# EasyEDA schematic 1-Schematic_RGBDiceTray_3.1.json

## Sheets
1 RGBDiceTray_Potentiometer: TITLE: RGBDiceTray_Potentiometer; REV: 1.0; Date: 2019-11-29; Sheet: 1/1; Drawn By: harrisongrout; Company: Your Company
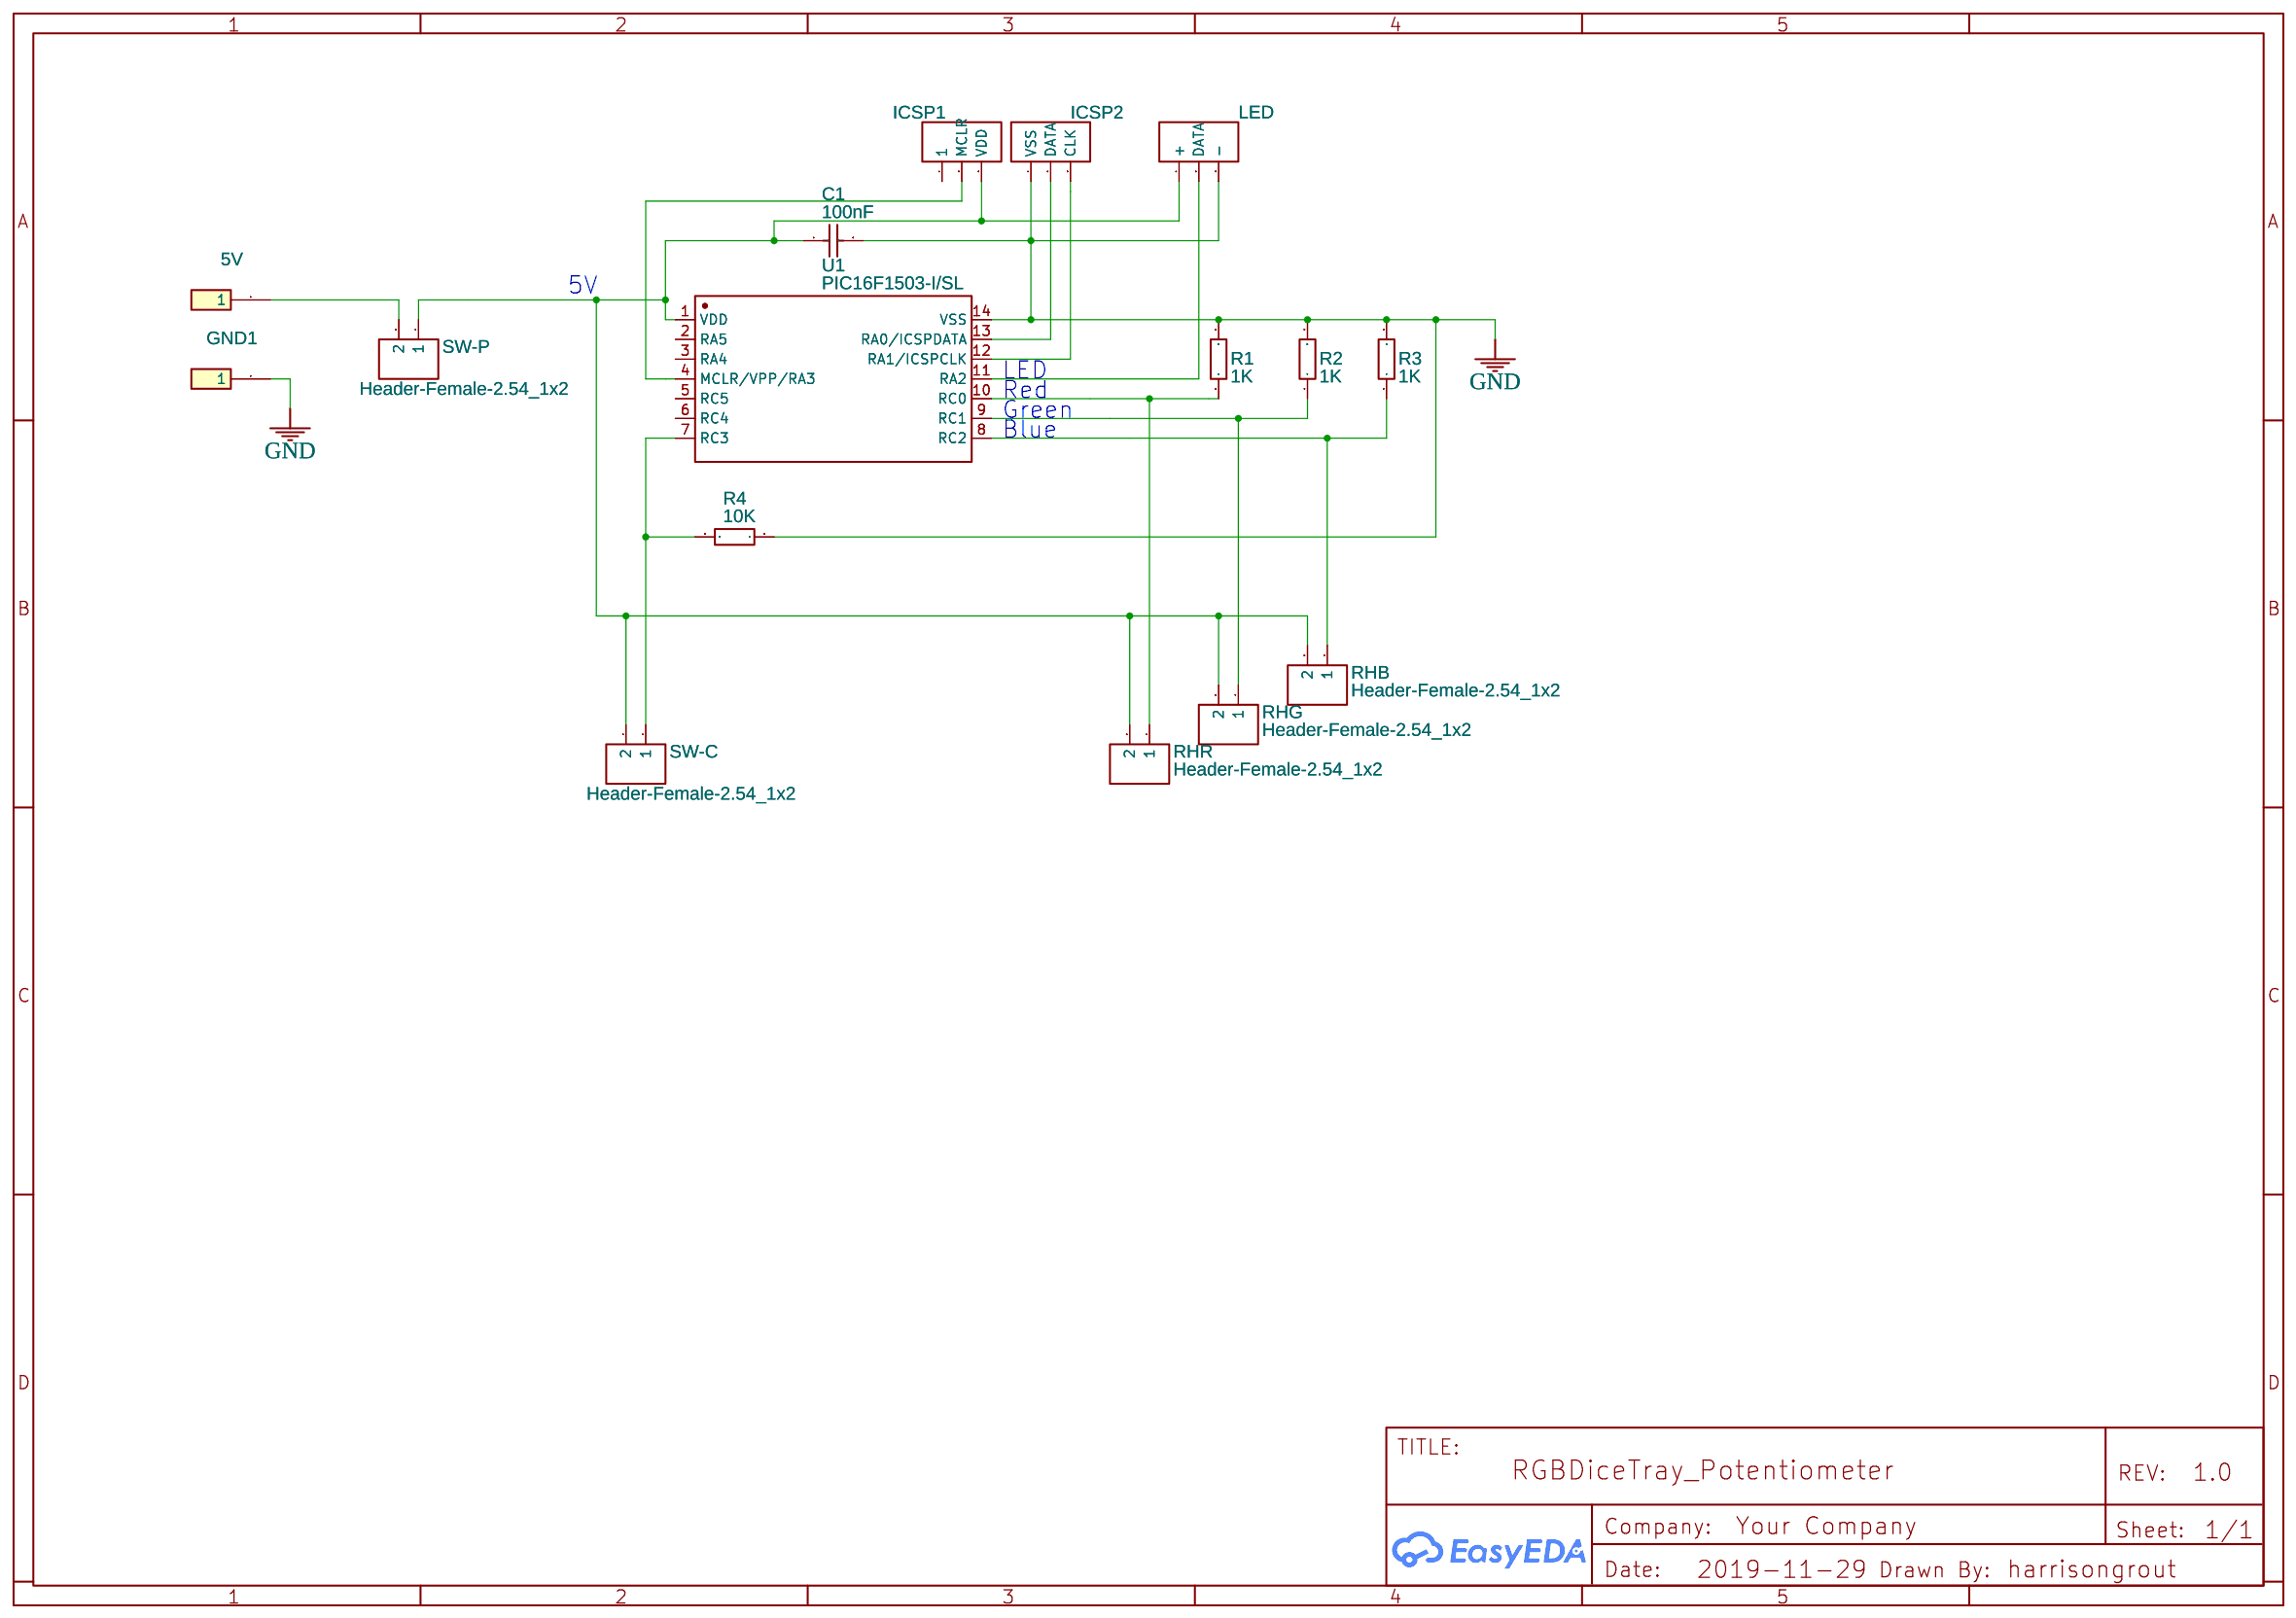
[diagram p0: RGBDiceTray_Potentiometer]
2 ButtonInterface: TITLE: Button Interface; Date: 2019-11-30
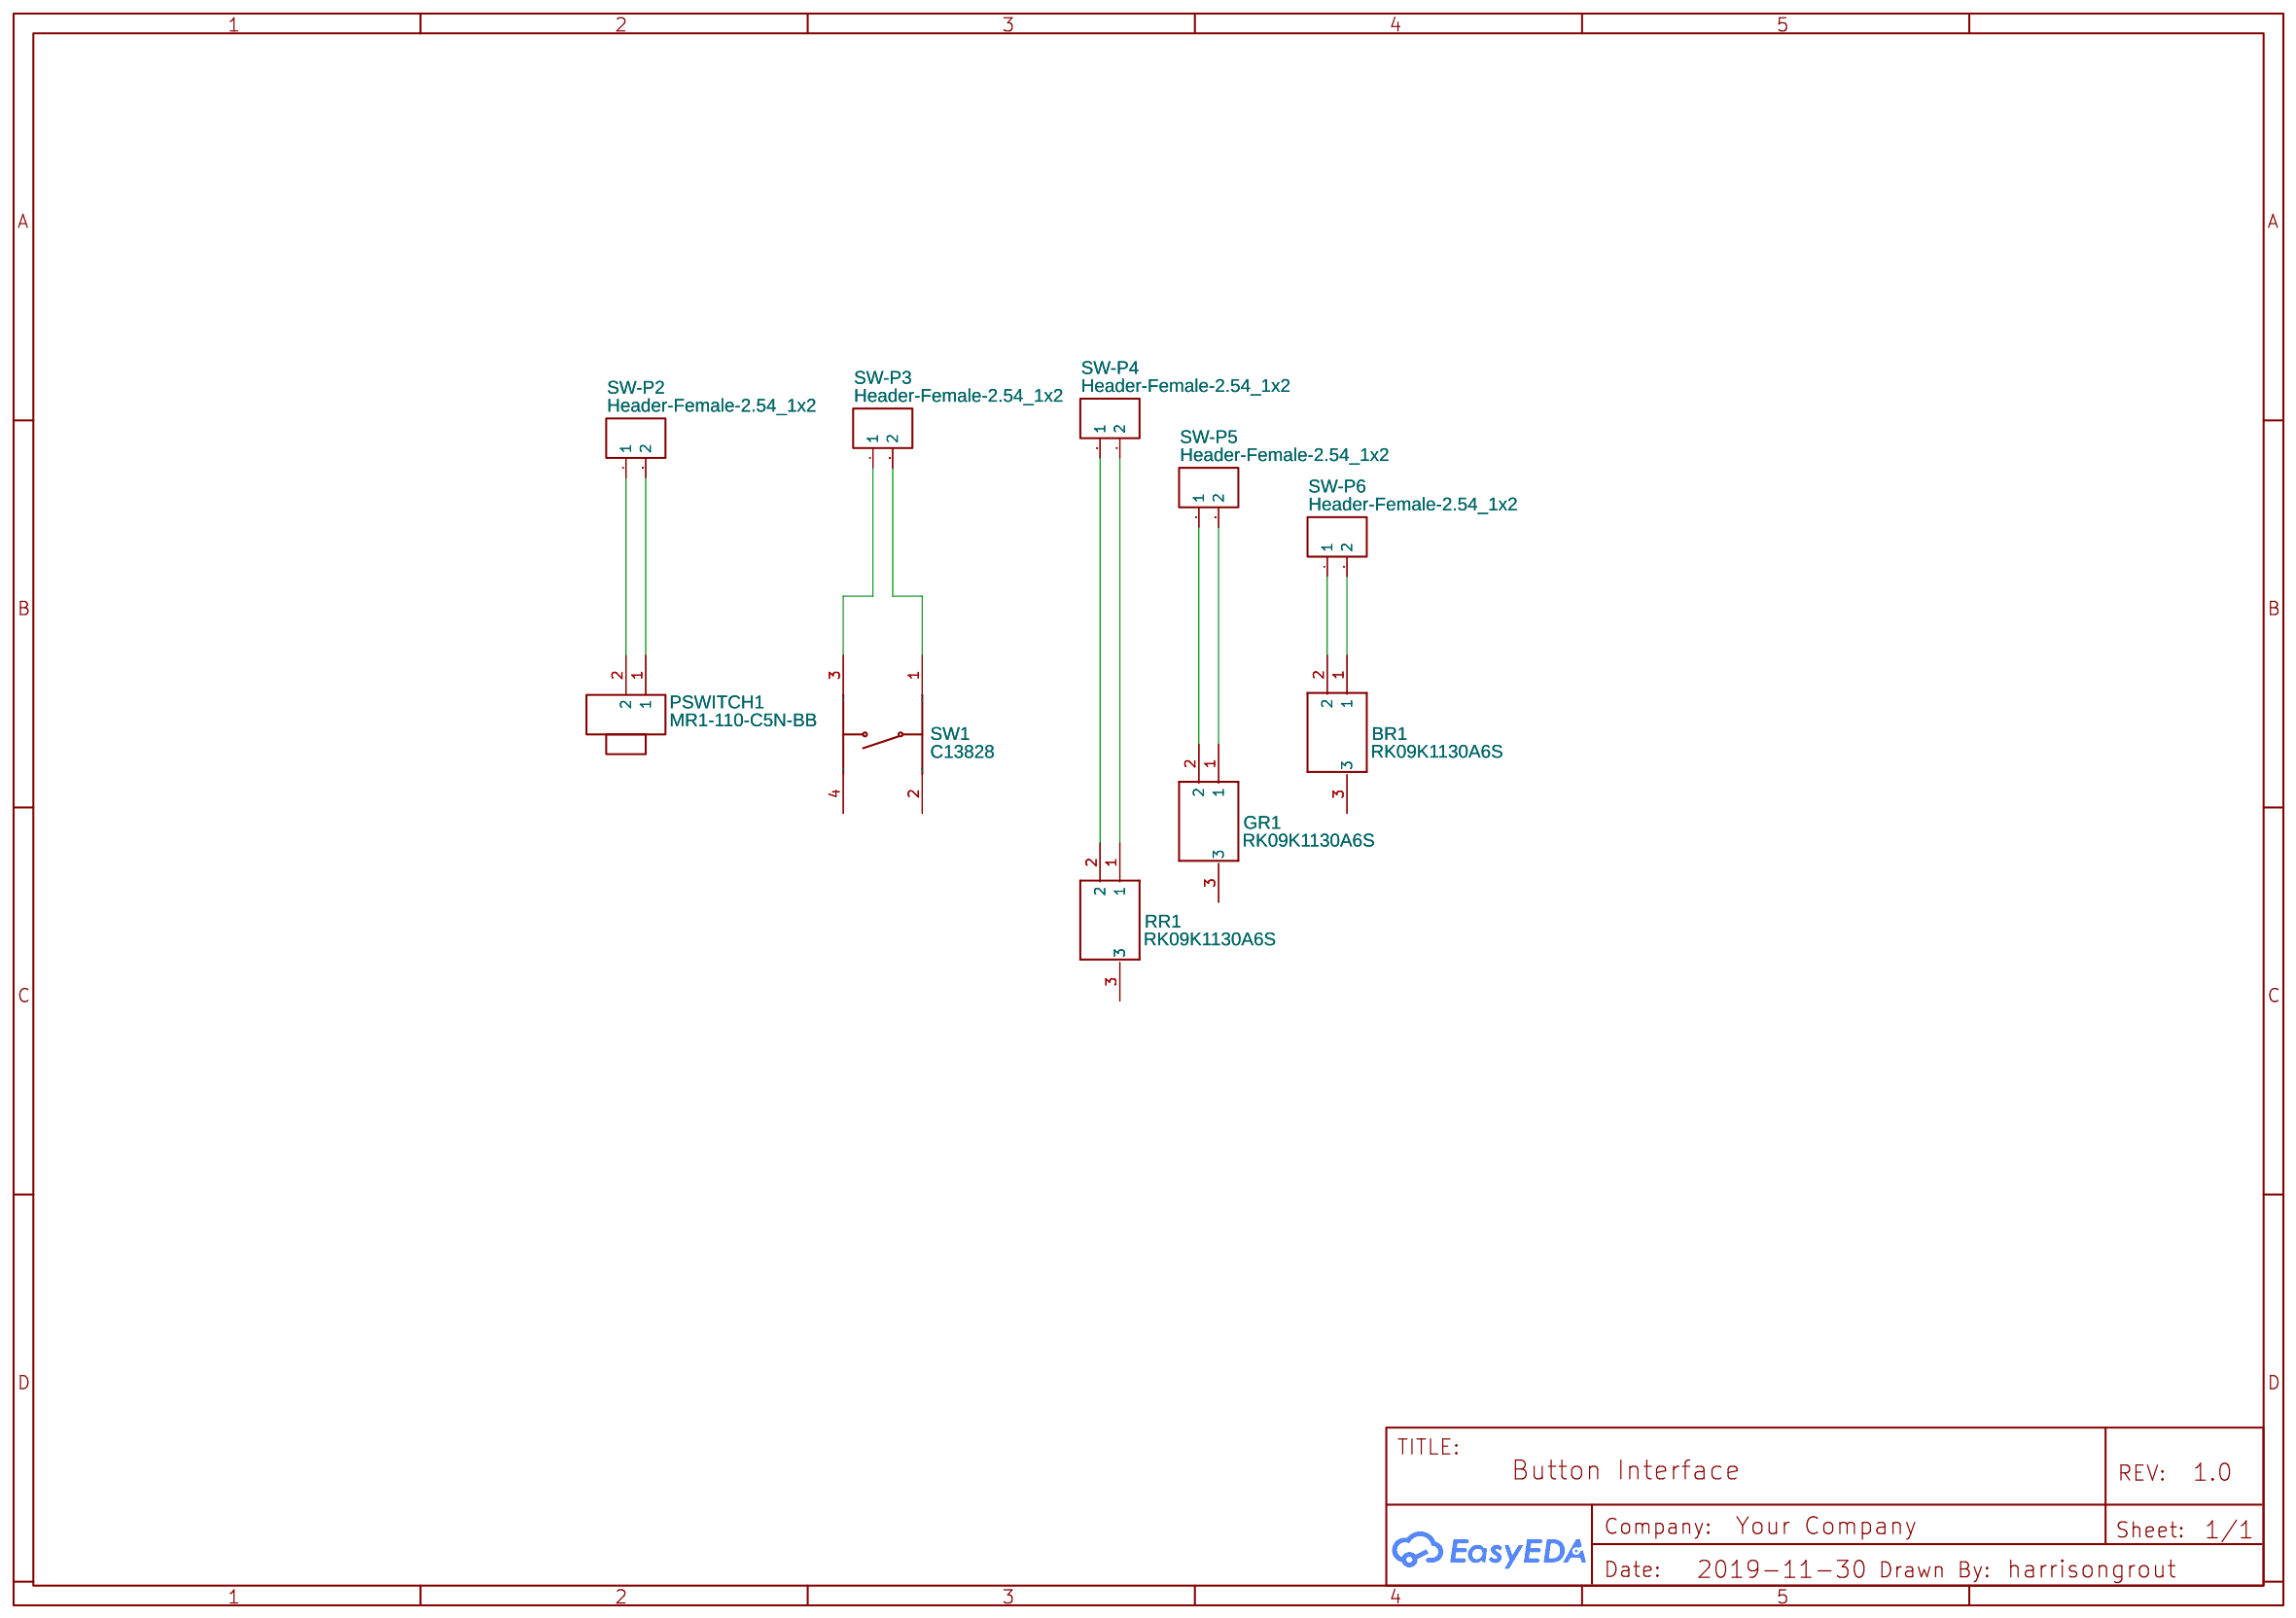
[diagram p1: ButtonInterface]

## Parts
sheet ButtonInterface
#1  -
BR1  RK09K1130A6S  [RK09K1130BGM]
GR1  RK09K1130A6S  [RK09K1130BGM]
PSWITCH1  MR1-110-C5N-BB  [601-10211BB-3P]
RR1  RK09K1130A6S  [RK09K1130BGM]
SW1  C13828  [SW-TH_4P-L6.0-W6.0-P4.50-LS6.5]
SW-P2  Header-Female-2.54_1x2  [HDR-TH_2P-P2.54-V-M]
SW-P3  Header-Female-2.54_1x2  [HDR-TH_2P-P2.54-V-M]
SW-P4  Header-Female-2.54_1x2  [HDR-TH_2P-P2.54-V-M]
SW-P5  Header-Female-2.54_1x2  [HDR-TH_2P-P2.54-V-M]
SW-P6  Header-Female-2.54_1x2  [HDR-TH_2P-P2.54-V-M]
sheet RGBDiceTray_Potentiometer
5V  5V  [HDR-1X1/2.54]
C1  100nF  [0402]
GND1  GND  [HDR-1X1/2.54]
ICSP1  Male Header Pins 1x3 THT - ADV (C49257)  [HDR-3X1/2.54]
ICSP2  Male Header Pins 1x3 THT - ADV (C49257)  [HDR-3X1/2.54]
LED  Male Header Pins 1x3 THT - ADV (C49257)  [HDR-3X1/2.54]
R1  1K  [0603]
R2  1K  [0603]
R3  1K  [0603]
R4  10K  [0402]
RHB  Header-Female-2.54_1x2  [HDR-TH_2P-P2.54-V-M]
RHG  Header-Female-2.54_1x2  [HDR-TH_2P-P2.54-V-M]
RHR  Header-Female-2.54_1x2  [HDR-TH_2P-P2.54-V-M]
SW-C  Header-Female-2.54_1x2  [HDR-TH_2P-P2.54-V-M]
SW-P  Header-Female-2.54_1x2  [HDR-TH_2P-P2.54-V-M]
U1  PIC16F1503-I/SL  [SOIC-14_L8.7-W3.9-P1.27-LS6.0-BL]

## Library data of the parts
#1 = -: BOM_Manufacturer Part: ?
BR1 GR1 RR1 = -: Contributor: emilgora
PSWITCH1 = -: Supplier: LCSC; Manufacturer: HONGJU; image: //image.lceda.cn/szlcsc/C67849.jpg; Supplier Part: C268222; Contributor: Samuele Torregrossa
SW1 = -: Supplier: LCSC; Manufacturer: Dongguan Guangzhu Industrial; Contributor: LCSC
RHB RHG RHR SW-C SW-P SW-P2-SW-P6 = -: Supplier: LCSC; Manufacturer: BOOMELE; Manufacturer Part: 2.54-1*2PFemale; image: //image.lceda.cn/szlcsc/C49661.jpg; Supplier Part: C49661
5V GND1 = -: Supplier: LCSC; Manufacturer: LCSC; Manufacturer Part: Header-Male-2.54_1x1; Supplier Part: C81276
C1 = CL05B104KO5NNNC: Supplier: LCSC; Manufacturer: SAMSUNG; LCSC Assembly: Yes; Supplier Part: C1525; SMT Type: Basic
ICSP1 ICSP2 LED = -: Supplier: LCSC; Manufacturer: BOOMELE; Manufacturer Part: Header2.54mm 1*3P; image: //image.lceda.cn/szlcsc/C49257.jpg; Supplier Part: C49257
R1-R3 = CR0603JA0102G: Supplier: LCSC; Manufacturer: LIZ; Supplier Part: C101253
R4 = RC0402JR-0710KL: Supplier: LCSC; Manufacturer: YAGEO; Supplier Part: C60489
U1 = -: Supplier: LCSC; Manufacturer: MICROCHIP; Supplier Part: C22139

## Nets
GND: C1.2 GND1.1 ICSP2.1(VSS) LED.3(-) R1.2 R2.2 R3.2 R4.1 U1.14(VSS)
Net-(5V-1): 5V.1 SW-P.2
Net-(BR1-1): BR1.1 SW-P6.2
Net-(BR1-2): BR1.2 SW-P6.1
Net-(C1-1): C1.1 ICSP1.3(VDD) LED.1(+) RHB.2 RHG.2 RHR.2 SW-C.2 SW-P.1 U1.1(VDD)
Net-(GR1-1): GR1.1 SW-P5.2
Net-(GR1-2): GR1.2 SW-P5.1
Net-(ICSP1-2): ICSP1.2(MCLR) U1.4(MCLR/VPP/RA3)
Net-(ICSP2-2): ICSP2.2(DATA) U1.13(RA0/ICSPDATA)
Net-(ICSP2-3): ICSP2.3(CLK) U1.12(RA1/ICSPCLK)
Net-(LED-2): LED.2(DATA) U1.11(RA2)
Net-(PSWITCH1-1): PSWITCH1.1 SW-P2.2
Net-(PSWITCH1-2): PSWITCH1.2 SW-P2.1
Net-(R1-1): R1.1 RHR.1 U1.10(RC0)
Net-(R2-1): R2.1 RHG.1 U1.9(RC1)
Net-(R3-1): R3.1 RHB.1 U1.8(RC2)
Net-(R4-2): R4.2 SW-C.1 U1.7(RC3)
Net-(RR1-1): RR1.1 SW-P4.2
Net-(RR1-2): RR1.2 SW-P4.1
Net-(SW1-1): SW1.1 SW-P3.2
Net-(SW1-3): SW1.3 SW-P3.1

Not connected (* = marked no-connect by the designer): BR1 3; GR1 3; ICSP1 1; RR1 3; SW1 2 4; U1 2(RA5) 3(RA4) 5(RC5) 6(RC4)

## Notes on the sheets
sheet 1
- 5V
- LED
- Red
- Blue
- Green
